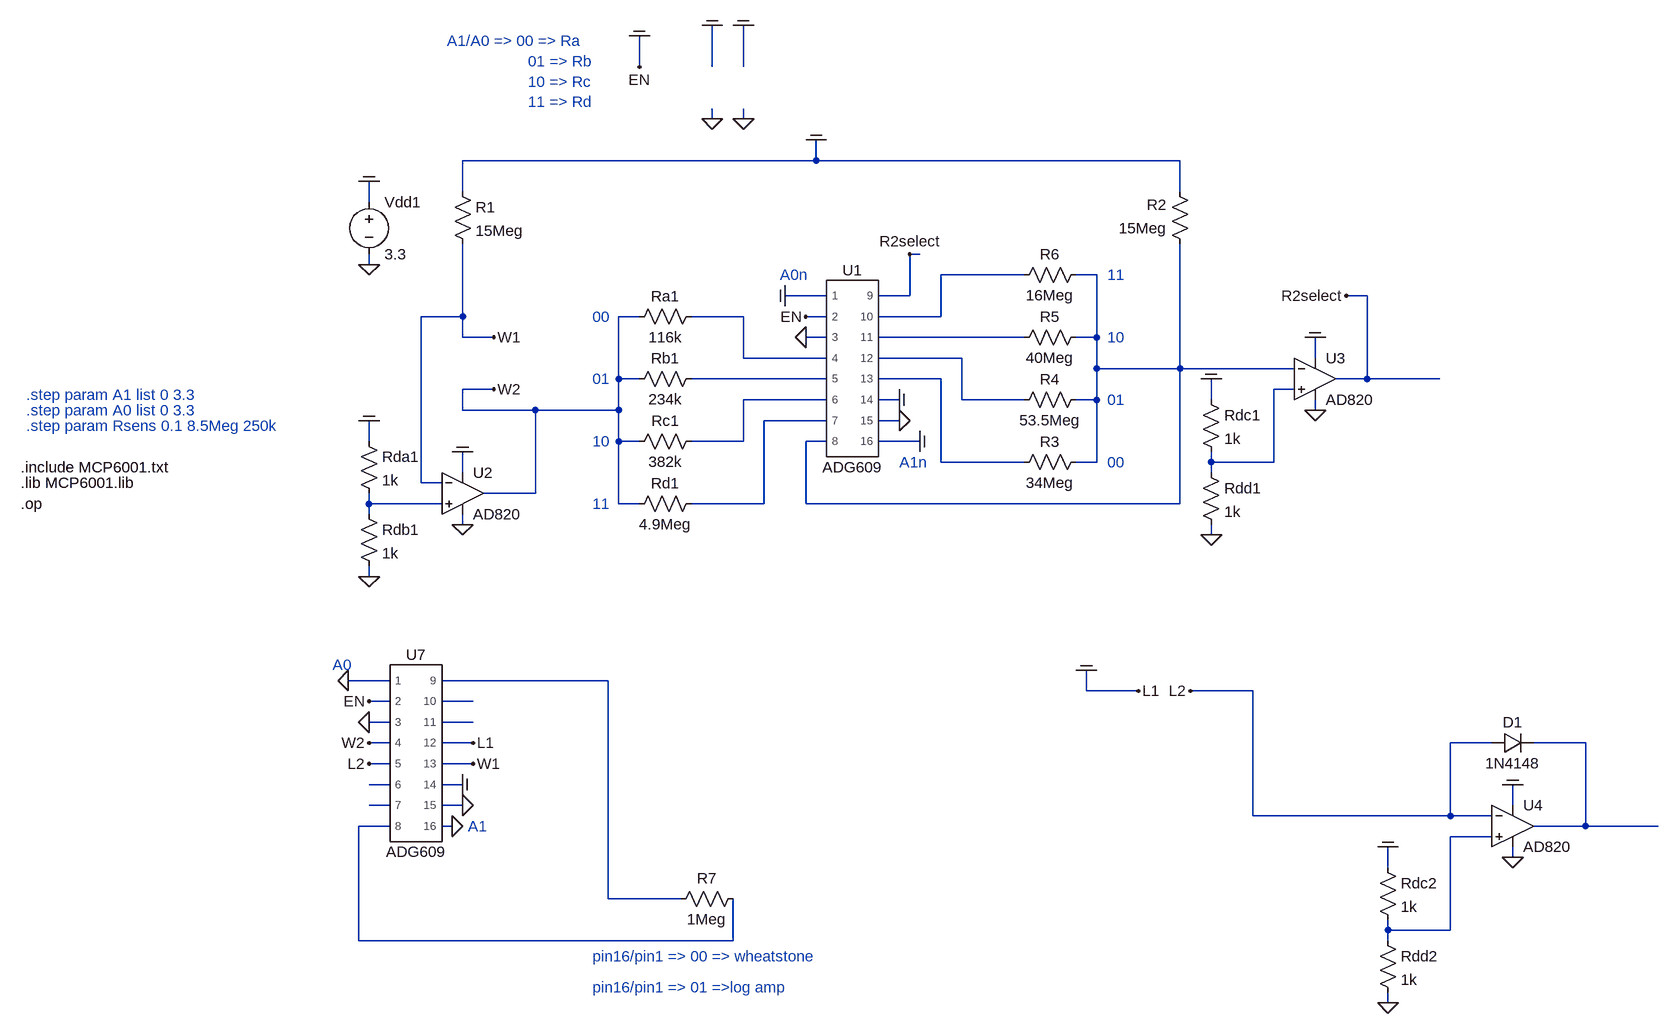
[diagram p0: schematic LogWheat.asc]
LogWheat.asc, the LTspice schematic file:
Version 4
SHEET 1 1640 852
WIRE -32 -608 -32 -656
WIRE 80 -608 80 -672
WIRE 128 -608 128 -672
WIRE 80 -528 80 -544
WIRE 128 -528 128 -544
WIRE 240 -464 240 -496
WIRE 240 -464 -304 -464
WIRE 800 -464 240 -464
WIRE -304 -416 -304 -464
WIRE 800 -416 800 -464
WIRE -448 -400 -448 -432
WIRE 400 -320 384 -320
WIRE -448 -304 -448 -320
WIRE 560 -288 432 -288
WIRE 672 -288 640 -288
WIRE 256 -256 192 -256
WIRE 384 -256 384 -320
WIRE 384 -256 336 -256
WIRE 1088 -256 1056 -256
WIRE -304 -224 -304 -336
WIRE -304 -224 -368 -224
WIRE -32 -224 -64 -224
WIRE 128 -224 48 -224
WIRE 256 -224 224 -224
WIRE 432 -224 432 -288
WIRE 432 -224 336 -224
WIRE -304 -192 -304 -224
WIRE -256 -192 -304 -192
WIRE 256 -192 224 -192
WIRE 560 -192 336 -192
WIRE 672 -192 672 -288
WIRE 672 -192 640 -192
WIRE 128 -160 128 -224
WIRE 256 -160 128 -160
WIRE 464 -160 336 -160
WIRE 1008 -160 1008 -192
WIRE 672 -144 672 -192
WIRE 800 -144 800 -336
WIRE 800 -144 672 -144
WIRE 976 -144 800 -144
WIRE -64 -128 -64 -224
WIRE -32 -128 -64 -128
WIRE 256 -128 48 -128
WIRE 432 -128 336 -128
WIRE 1088 -128 1088 -256
WIRE 1088 -128 1040 -128
WIRE 1200 -128 1088 -128
WIRE -256 -112 -304 -112
WIRE 976 -112 944 -112
WIRE 256 -96 128 -96
WIRE 368 -96 336 -96
WIRE 464 -96 464 -160
WIRE 560 -96 464 -96
WIRE 672 -96 672 -144
WIRE 672 -96 640 -96
WIRE 848 -96 848 -128
WIRE -304 -80 -304 -112
WIRE -192 -80 -304 -80
WIRE -64 -80 -64 -128
WIRE -64 -80 -192 -80
WIRE 1008 -80 1008 -96
WIRE 256 -64 160 -64
WIRE 368 -64 336 -64
WIRE -448 -32 -448 -64
WIRE -64 -32 -64 -80
WIRE -32 -32 -64 -32
WIRE 128 -32 128 -96
WIRE 128 -32 48 -32
WIRE 256 -32 224 -32
WIRE 400 -32 336 -32
WIRE 432 0 432 -128
WIRE 560 0 432 0
WIRE 672 0 672 -96
WIRE 672 0 640 0
WIRE 848 0 848 -16
WIRE 944 0 944 -112
WIRE 944 0 848 0
WIRE -304 16 -304 -16
WIRE 848 16 848 0
WIRE -368 32 -368 -224
WIRE -336 32 -368 32
WIRE -192 48 -192 -80
WIRE -192 48 -272 48
WIRE -448 64 -448 48
WIRE -336 64 -448 64
WIRE -64 64 -64 -32
WIRE -32 64 -64 64
WIRE 160 64 160 -64
WIRE 160 64 48 64
WIRE 224 64 224 -32
WIRE 800 64 800 -144
WIRE 800 64 224 64
WIRE -448 80 -448 64
WIRE -304 96 -304 80
WIRE 848 112 848 96
WIRE -448 176 -448 160
WIRE -416 336 -480 336
WIRE -80 336 -336 336
WIRE 656 352 656 320
WIRE 736 352 656 352
WIRE 912 352 816 352
WIRE -416 368 -448 368
WIRE -288 368 -336 368
WIRE -416 400 -448 400
WIRE -288 400 -336 400
WIRE -416 432 -448 432
WIRE -288 432 -336 432
WIRE 1280 432 1216 432
WIRE 1424 432 1344 432
WIRE -416 464 -448 464
WIRE -288 464 -336 464
WIRE -416 496 -448 496
WIRE -304 496 -336 496
WIRE -416 528 -448 528
WIRE -304 528 -336 528
WIRE 1312 528 1312 496
WIRE 912 544 912 352
WIRE 1216 544 1216 432
WIRE 1216 544 912 544
WIRE 1280 544 1216 544
WIRE -416 560 -464 560
WIRE -320 560 -336 560
WIRE 1424 560 1424 432
WIRE 1424 560 1344 560
WIRE 1536 560 1424 560
WIRE 1280 576 1216 576
WIRE 1312 608 1312 592
WIRE 1120 624 1120 592
WIRE -80 672 -80 336
WIRE 32 672 -80 672
WIRE 1120 720 1120 704
WIRE 1216 720 1216 576
WIRE 1216 720 1120 720
WIRE -464 736 -464 560
WIRE 112 736 112 672
WIRE 112 736 -464 736
WIRE 1120 736 1120 720
WIRE 1120 832 1120 816
FLAG 224 -224 EN
FLAG 224 -192 0
FLAG 368 -96 COM
FLAG 368 -64 0
FLAG 848 112 0
FLAG 848 -128 COM
FLAG 1008 -80 0
FLAG 1008 -192 COM
FLAG -304 96 0
FLAG -304 -16 COM
FLAG -448 176 0
FLAG -448 -64 COM
FLAG -32 -608 EN
FLAG -32 -656 COM
FLAG -448 -432 COM
FLAG -448 -304 0
FLAG 80 -528 0
FLAG 240 -496 COM
FLAG 384 -320 R2select
FLAG 1056 -256 R2select
FLAG 128 -528 0
FLAG 400 -32 COM
FLAG 192 -256 COM
FLAG 80 -672 COM
FLAG 128 -672 COM
FLAG 1312 608 0
FLAG 1312 496 COM
FLAG 736 352 L1
FLAG 816 352 L2
FLAG 656 320 COM
FLAG -448 368 EN
FLAG -304 496 COM
FLAG -304 528 0
FLAG -448 400 0
FLAG -448 464 L2
FLAG -320 560 0
FLAG -448 432 W2
FLAG -256 -112 W2
FLAG -256 -192 W1
FLAG -288 464 W1
FLAG -288 432 L1
FLAG -480 336 0
FLAG 1120 832 0
FLAG 1120 592 COM
DATAFLAG 1184 -128 ""
DATAFLAG 1504 560 ""
DATAFLAG -192 -464 ""
DATAFLAG -368 -64 ""
DATAFLAG -144 -80 ""
DATAFLAG -304 -272 ""
DATAFLAG 96 -224 ""
DATAFLAG 96 -128 ""
DATAFLAG 96 -32 ""
DATAFLAG 96 64 ""
DATAFLAG 384 64 ""
DATAFLAG 736 -464 ""
DATAFLAG 944 0 ""
DATAFLAG 880 -144 ""
DATAFLAG 1088 -256 ""
DATAFLAG 400 -224 ""
DATAFLAG 416 -192 ""
DATAFLAG 448 -160 ""
DATAFLAG 464 0 ""
DATAFLAG 1216 720 ""
SYMBOL ADG609 288 -144 R0
SYMATTR InstName U1
SYMBOL res -320 -432 R0
SYMATTR InstName R1
SYMATTR Value 15Meg
SYMBOL res 816 -320 R180
WINDOW 0 36 76 Left 2
WINDOW 3 36 40 Left 2
SYMATTR InstName R2
SYMATTR Value 15Meg
SYMBOL res 832 -112 R0
SYMATTR InstName Rdc1
SYMATTR Value 1k
SYMBOL res 832 0 R0
SYMATTR InstName Rdd1
SYMATTR Value 1k
SYMBOL res 656 -16 R90
WINDOW 0 0 56 VBottom 2
WINDOW 3 32 56 VTop 2
SYMATTR InstName R3
SYMATTR Value 34Meg
SYMBOL res -464 -48 R0
SYMATTR InstName Rda1
SYMATTR Value 1k
SYMBOL res -464 64 R0
SYMATTR InstName Rdb1
SYMATTR Value 1k
SYMBOL voltage -448 -416 R0
SYMATTR InstName Vdd1
SYMATTR Value 3.3
SYMBOL res 64 -240 R90
WINDOW 0 0 56 VBottom 2
WINDOW 3 32 56 VTop 2
SYMATTR InstName Ra1
SYMATTR Value 116k
SYMBOL res 64 -144 R90
WINDOW 0 0 56 VBottom 2
WINDOW 3 32 56 VTop 2
SYMATTR InstName Rb1
SYMATTR Value 234k
SYMBOL res 64 -48 R90
WINDOW 0 0 56 VBottom 2
WINDOW 3 32 56 VTop 2
SYMATTR InstName Rc1
SYMATTR Value 382k
SYMBOL res 64 48 R90
WINDOW 0 0 56 VBottom 2
WINDOW 3 32 56 VTop 2
SYMATTR InstName Rd1
SYMATTR Value 4.9Meg
SYMBOL OpAmps\\AD820 -304 -16 R0
SYMATTR InstName U2
SYMBOL OpAmps\\AD820 1008 -192 R0
SYMATTR InstName U3
SYMBOL res 656 -112 R90
WINDOW 0 0 56 VBottom 2
WINDOW 3 32 56 VTop 2
SYMATTR InstName R4
SYMATTR Value 53.5Meg
SYMBOL res 656 -208 R90
WINDOW 0 0 56 VBottom 2
WINDOW 3 32 56 VTop 2
SYMATTR InstName R5
SYMATTR Value 40Meg
SYMBOL res 656 -304 R90
WINDOW 0 0 56 VBottom 2
WINDOW 3 32 56 VTop 2
SYMATTR InstName R6
SYMATTR Value 16Meg
SYMBOL diode 1280 448 R270
WINDOW 0 32 32 VTop 2
WINDOW 3 0 32 VBottom 2
SYMATTR InstName D1
SYMATTR Value 1N4148
SYMBOL OpAmps\\AD820 1312 496 R0
SYMATTR InstName U4
SYMBOL res 128 656 R90
WINDOW 0 0 56 VBottom 2
WINDOW 3 32 56 VTop 2
SYMATTR InstName R7
SYMATTR Value 1Meg
SYMBOL ADG609 -384 448 R0
SYMATTR InstName U7
SYMBOL res 1104 608 R0
SYMATTR InstName Rdc2
SYMATTR Value 1k
SYMBOL res 1104 720 R0
SYMATTR InstName Rdd2
SYMATTR Value 1k
TEXT -984 8 Left 2 !.include MCP6001.txt
TEXT -984 32 Left 2 !.lib MCP6001.lib
TEXT -328 -648 Left 2 ;A1/A0 => 00 => Ra\n                  01 => Rb\n                  10 => Rc\n                  11 => Rd
TEXT -104 -224 Left 2 ;00
TEXT -104 -128 Left 2 ;01
TEXT -104 -32 Left 2 ;10
TEXT -104 64 Left 2 ;11
TEXT 688 -288 Left 2 ;11
TEXT 688 -192 Left 2 ;10
TEXT 688 -96 Left 2 ;01
TEXT 688 0 Left 2 ;00
TEXT 368 0 Left 2 ;A1n
TEXT 184 -288 Left 2 ;A0n
TEXT -976 -104 Left 2 ;.step param A1 list 0 3.3
TEXT -976 -80 Left 2 ;.step param A0 list 0 3.3
TEXT -976 -56 Left 2 ;.step param Rsens 0.1 8.5Meg 250k
TEXT -984 64 Left 2 !.op
TEXT -104 760 Left 2 ;pin16/pin1 => 00 => wheatstone
TEXT -104 808 Left 2 ;pin16/pin1 => 01 =>log amp
TEXT -504 312 Left 2 ;A0
TEXT -296 560 Left 2 ;A1

The netlist it stands for:
* LogWheat.asc
XU1 L1 L1 0 N003 N006 N009 N010 N002 R2select N001 N004 N005 N007 L1 0 L1 ADG609  ; pins 1 2 3 4 5 6 7 8 9 10 11 12 13 14 15 16
R1 L1 W1 15Meg
R2 N002 L1 15Meg
Rdc1 L1 N008 1k
Rdd1 N008 0 1k
R3 N002 N007 34Meg
Rda1 L1 N011 1k
Rdb1 N011 0 1k
Vdd1 L1 0 3.3
Ra1 N003 W2 116k
Rb1 N006 W2 234k
Rc1 N009 W2 382k
Rd1 N010 W2 4.9Meg
XU2 N011 W1 L1 0 W2 AD820  ; pins In+ In- V+ V- OUT
XU3 N008 N002 L1 0 R2select AD820  ; pins In+ In- V+ V- OUT
R4 N002 N005 53.5Meg
R5 N002 N004 40Meg
R6 N002 N001 16Meg
D1 L2 N015 1N4148
XU4 N019 L2 L1 0 N015 AD820  ; pins In+ In- V+ V- OUT
R7 N018 N012 1Meg
XU7 0 L1 0 W2 L2 N016 N017 N018 N012 N013 N014 L1 W1 L1 0 0 ADG609  ; pins 1 2 3 4 5 6 7 8 9 10 11 12 13 14 15 16
Rdc2 L1 N019 1k
Rdd2 N019 0 1k
.model D D
.lib standard.dio
.include MCP6001.txt
.lib MCP6001.lib
* A1/A0 => 00 => Ra
*                   01 => Rb
*                   10 => Rc
*                   11 => Rd
* 00
* 01
* 10
* 11
* 11
* 10
* 01
* 00
* A1n
* A0n
* .step param A1 list 0 3.3
* .step param A0 list 0 3.3
* .step param Rsens 0.1 8.5Meg 250k
.op
* pin16/pin1 => 00 => wheatstone
* pin16/pin1 => 01 =>log amp
* A0
* A1
.lib C:\Users\zacha\Desktop\MyFiles\Research Project\LTSpice\All_Models\adg609.cir
.backanno
.end